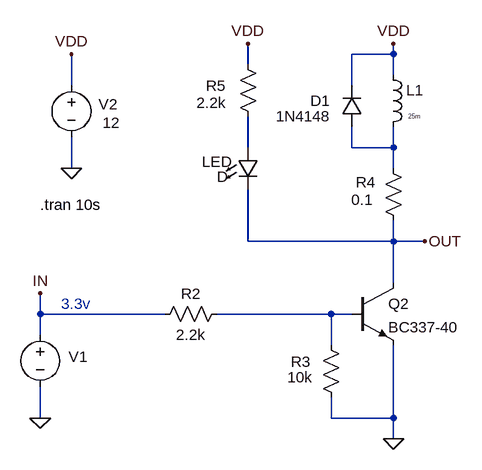
[diagram p0: schematic v1.0.asc]
v1.0.asc, the LTspice schematic file:
Version 4.1
SHEET 1 1332 680
WIRE 784 -176 784 -192
WIRE 784 -176 720 -176
WIRE 560 -160 560 -192
WIRE 784 -144 784 -176
WIRE 288 -128 288 -176
WIRE 720 -128 720 -176
WIRE 560 -32 560 -80
WIRE 720 -32 720 -64
WIRE 784 -32 784 -64
WIRE 784 -32 720 -32
WIRE 288 0 288 -48
WIRE 784 0 784 -32
WIRE 560 112 560 32
WIRE 784 112 784 80
WIRE 784 112 560 112
WIRE 832 112 784 112
WIRE 784 176 784 112
WIRE 240 224 240 192
WIRE 432 224 240 224
WIRE 688 224 512 224
WIRE 720 224 688 224
WIRE 240 256 240 224
WIRE 688 272 688 224
WIRE 240 384 240 336
WIRE 688 384 688 352
WIRE 784 384 784 272
WIRE 784 384 688 384
WIRE 784 416 784 384
FLAG 240 384 0
FLAG 288 0 0
FLAG 240 192 IN
FLAG 784 416 0
FLAG 288 -176 VDD
FLAG 784 -192 VDD
FLAG 832 112 OUT
FLAG 560 -192 VDD
SYMBOL voltage 240 240 R0
WINDOW 123 0 0 Left 0
WINDOW 39 0 0 Left 0
WINDOW 0 44 50 Left 2
WINDOW 3 43 83 Invisible 2
SYMATTR InstName V1
SYMATTR Value PULSE(0 3.3 2 1n 1n 2 4)
SYMBOL res 528 208 R90
WINDOW 0 0 56 VBottom 2
WINDOW 3 32 56 VTop 2
SYMATTR InstName R2
SYMATTR Value 2.2k
SYMBOL voltage 288 -144 R0
WINDOW 123 0 0 Left 0
WINDOW 39 0 0 Left 0
WINDOW 0 42 45 Left 2
WINDOW 3 48 74 Left 2
SYMATTR InstName V2
SYMATTR Value 12
SYMBOL npn 720 176 R0
SYMATTR InstName Q2
SYMATTR Value BC337-40
SYMBOL res 672 256 R0
WINDOW 0 -46 41 Left 2
WINDOW 3 -51 65 Left 2
SYMATTR InstName R3
SYMATTR Value 10k
SYMBOL ind 768 -160 R0
WINDOW 3 39 80 Left 0
SYMATTR Value 25m
SYMATTR InstName L1
SYMATTR SpiceLine Rser=120
SYMBOL res 768 -16 R0
WINDOW 0 -42 37 Left 2
WINDOW 3 -49 64 Left 2
SYMATTR InstName R4
SYMATTR Value 0.1
SYMBOL LED 544 -32 R0
WINDOW 0 -55 22 Left 2
WINDOW 3 -32 45 Left 2
SYMATTR InstName LED
SYMBOL res 544 -176 R0
WINDOW 0 -49 49 Left 2
WINDOW 3 -63 75 Left 2
SYMATTR InstName R5
SYMATTR Value 2.2k
SYMBOL diode 736 -64 R180
WINDOW 0 49 40 Left 2
WINDOW 3 48 16 Left 2
SYMATTR InstName D1
SYMATTR Value 1N4148
TEXT 240 56 Left 2 !.tran 10s
TEXT 272 208 Left 2 ;3.3v

The netlist it stands for:
* v1.0.asc
V1 IN 0 PULSE(0 3.3 2 1n 1n 2 4)
R2 N003 IN 2.2k
V2 VDD 0 12
Q2 OUT N003 0 0 BC337-40
R3 N003 0 10k
L1 VDD N002 25m Rser=120
R4 N002 OUT 0.1
D§LED N001 OUT D
R5 VDD N001 2.2k
D1 N002 VDD 1N4148
.model D D
.lib standard.dio
.model NPN NPN
.model PNP PNP
.lib standard.bjt
.tran 10s
* 3.3v
.backanno
.end

* Results of the author's LTspice run, read from the files saved beside the schematic
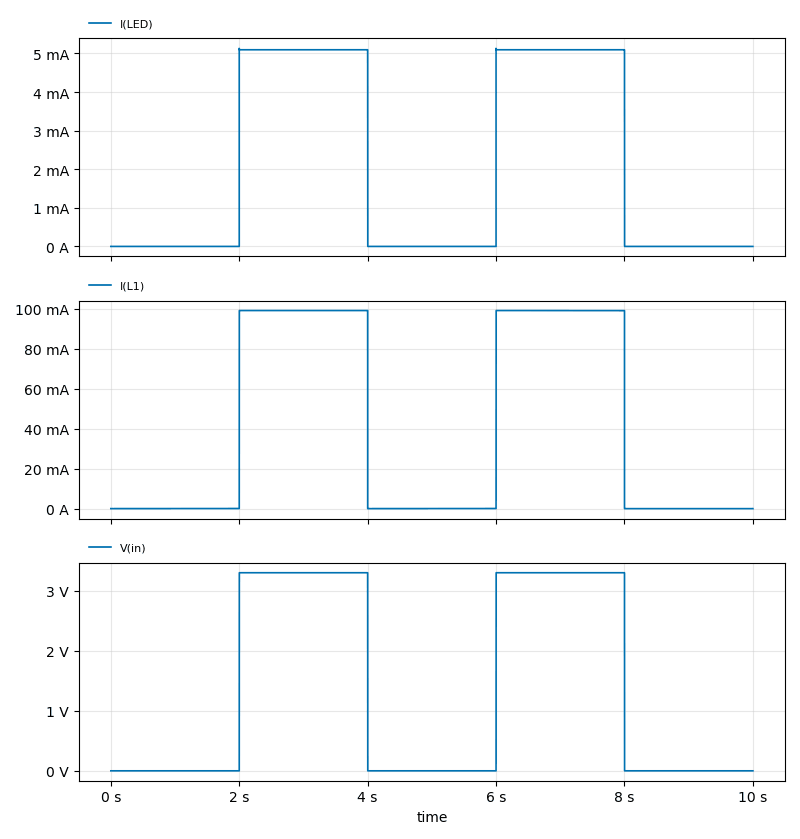
[diagram p1: Transient Analysis of v1.0.asc, plotted from the saved traces]
* Transient Analysis, 1 run:
*   I(LED): min 0 A, max 5.133 mA, average 2.039 mA, rms 3.223 mA, last 0 A
*   I(L1): min -4.189 µA, max 99.16 mA, average 39.66 mA, rms 62.71 mA, last 0 A
*   V(in): min 0 V, max 3.3 V, average 1.32 V, rms 2.087 V, last 0 V